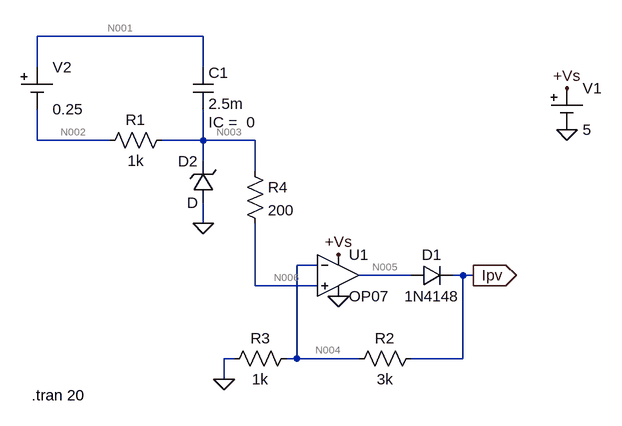
[diagram p0: schematic Draft5.asc]
Draft5.asc, the LTspice schematic file:
Version 4
SHEET 1 952 680
WIRE 336 96 80 96
WIRE 80 144 80 96
WIRE 336 144 336 96
WIRE 80 256 80 208
WIRE 192 256 80 256
WIRE 336 256 336 208
WIRE 336 256 272 256
WIRE 416 256 336 256
WIRE 336 288 336 256
WIRE 416 304 416 256
WIRE 336 384 336 352
WIRE 512 448 480 448
WIRE 656 464 576 464
WIRE 736 464 720 464
WIRE 752 464 736 464
WIRE 416 480 416 384
WIRE 512 480 416 480
WIRE 384 592 368 592
WIRE 480 592 480 448
WIRE 480 592 464 592
WIRE 576 592 480 592
WIRE 736 592 736 464
WIRE 736 592 656 592
WIRE 368 624 368 592
FLAG 544 432 +Vs
FLAG 544 496 0
FLAG 336 384 0
FLAG 368 624 0
FLAG 896 240 0
FLAG 896 176 +Vs
FLAG 752 464 Ipv
IOPIN 752 464 Out
SYMBOL res 176 272 R270
WINDOW 0 32 56 VTop 2
WINDOW 3 0 56 VBottom 2
SYMATTR InstName R1
SYMATTR Value 1k
SYMBOL OpAmps\\OP07 544 400 R0
SYMATTR InstName U1
SYMBOL diode 656 480 R270
WINDOW 0 32 32 VTop 2
WINDOW 3 0 32 VBottom 2
SYMATTR InstName D1
SYMATTR Value 1N4148
SYMBOL res 672 576 R90
WINDOW 0 0 56 VBottom 2
WINDOW 3 32 56 VTop 2
SYMATTR InstName R2
SYMATTR Value 3k
SYMBOL res 480 576 R90
WINDOW 0 0 56 VBottom 2
WINDOW 3 32 56 VTop 2
SYMATTR InstName R3
SYMATTR Value 1k
SYMBOL res 400 288 R0
SYMATTR InstName R4
SYMATTR Value 200
SYMBOL Misc\\cell 896 176 R0
WINDOW 123 0 0 Left 0
WINDOW 39 0 0 Left 0
SYMATTR InstName V1
SYMATTR Value 5
SYMBOL cap 320 144 R0
WINDOW 39 24 84 Left 2
SYMATTR InstName C1
SYMATTR Value 2.5m
SYMATTR SpiceLine IC =  0
SYMBOL zener 352 352 R180
WINDOW 0 24 64 Left 2
WINDOW 3 24 0 Left 2
SYMATTR InstName D2
SYMBOL Misc\\cell 80 144 R0
WINDOW 123 0 0 Left 0
WINDOW 39 0 0 Left 0
SYMATTR InstName V2
SYMATTR Value 0.25
TEXT 72 648 Left 2 !.tran 20

The netlist it stands for:
* Draft5.asc
R1 N002 N003 1k
XU1 N006 N004 +Vs 0 N005 LT1001  ; OP07, pins In+ In- V+ V- OUT
D1 N005 Ipv 1N4148
R2 Ipv N004 3k
R3 N004 0 1k
R4 N003 N006 200
V1 +Vs 0 5
C1 N001 N003 2.5m IC =  0
D2 0 N003 D
V2 N001 N002 0.25
.model D D
.lib standard.dio
.tran 20
.lib LTC.lib
.backanno
.end

* Results of the author's LTspice run, read from the files saved beside the schematic
* Operating Point, zero values left out:
*   V(n002) = 613.5 mV
*   V(n003) = 863.5 mV
*   V(n004) = 863.4 mV
*   V(n006) = 863.5 mV
*   V(+vs) = 5 V
*   V(n005) = 4.031 V
*   V(ipv) = 3.453 V
*   V(n001) = 863.5 mV
*   I(C1) = 250 µA
*   I(D1) = 863.4 µA
*   I(R1) = -250 µA
*   I(R2) = 863.4 µA
*   I(R3) = 863.4 µA
*   I(R4) = -1.008 pA
*   I(V1) = -2.702 mA
*   I(V2) = -250 µA
*   Ix(u1:1) = -1.008 pA
*   Ix(u1:2) = -4.837 pA
*   Ix(u1:3) = 2.702 mA
*   Ix(u1:4) = -1.839 mA
*   Ix(u1:5) = -863.4 µA
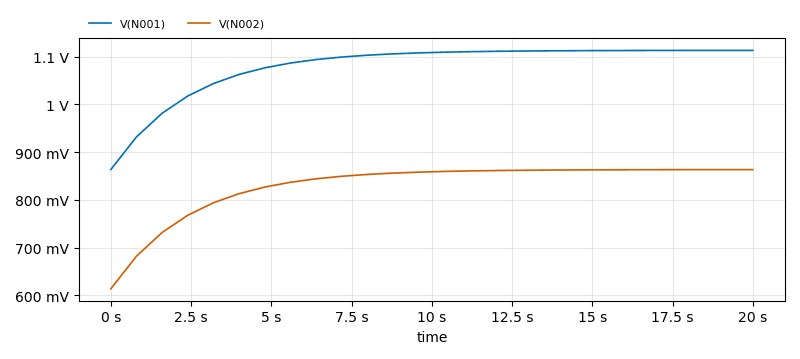
[diagram p1: Transient Analysis of Draft5.asc, plotted from the saved traces]
* Transient Analysis, 1 run:
*   V(N001): min 863.5 mV, max 1.113 V, average 1.082 V, rms 1.083 V, last 1.113 V
*   V(N002): min 613.5 mV, max 863.4 mV, average 832 mV, rms 833.8 mV, last 863.4 mV